# Altium schematic sheet C_M.SchDoc
size A4
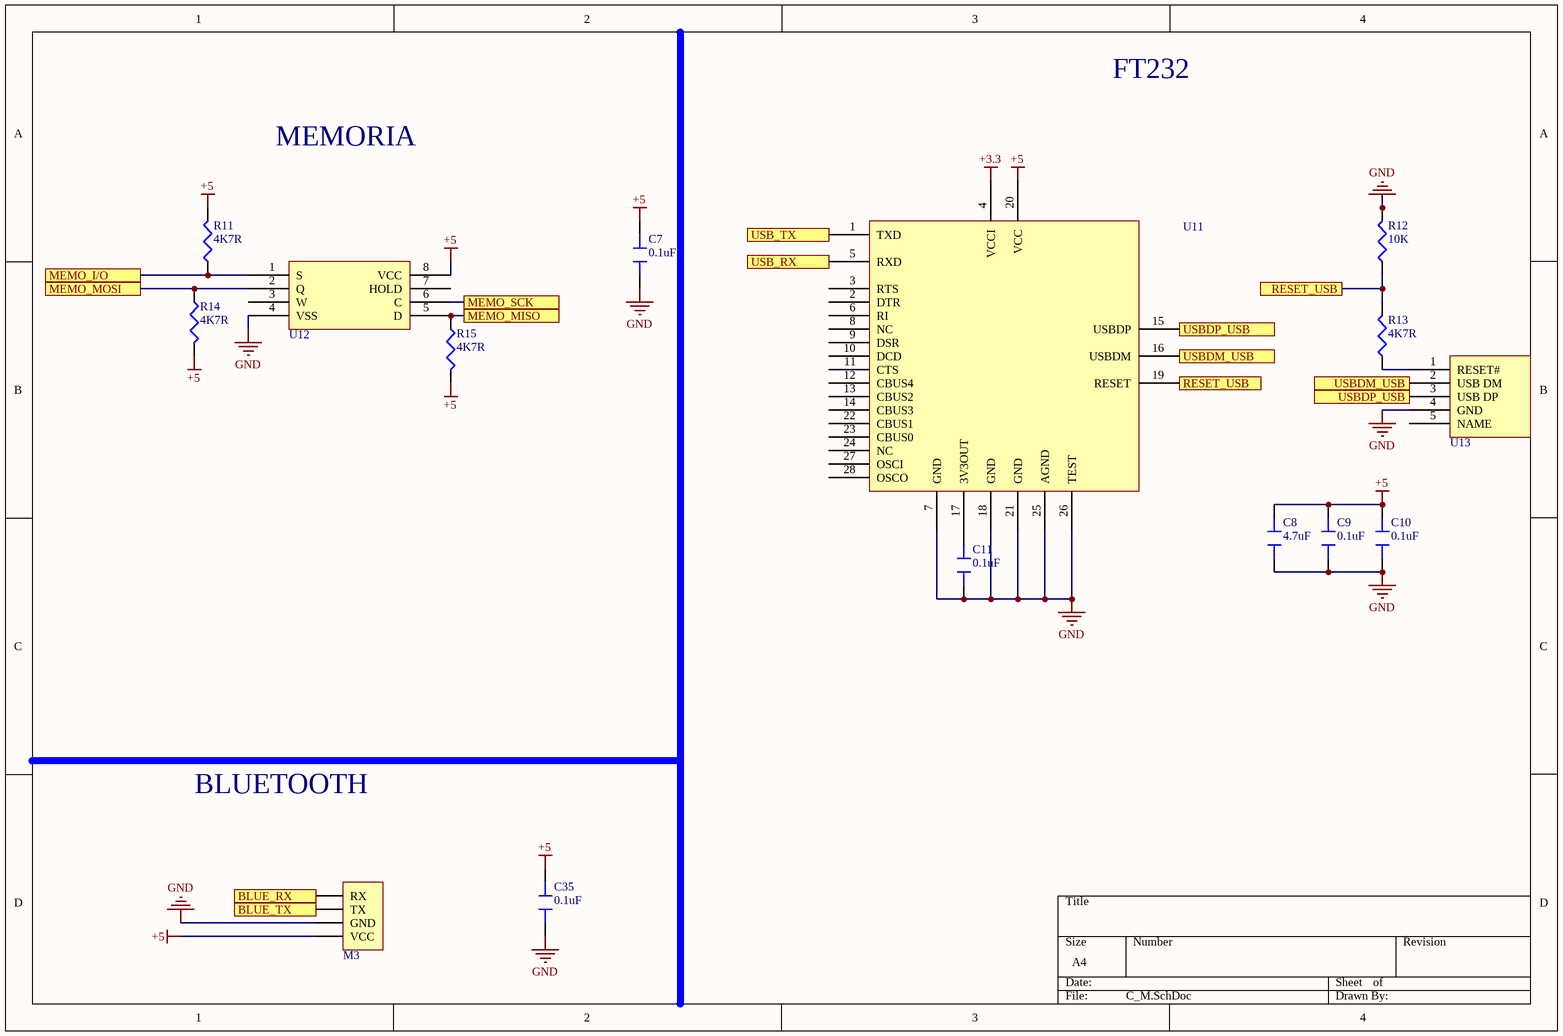
[diagram p0: C_M.SchDoc]

## Parts
C7  0.1uF  [CAPACITOR 0805]
C8  4.7uF  [CAPACITOR 0805]
C9  0.1uF  [CAPACITOR 0805]
C10  0.1uF  [CAPACITOR 0805]
C11  0.1uF  [CAPACITOR 0805]
C35  0.1uF  [CAPACITOR 0805]
M3  Headers (1x4)_BLUE  [HDR1X4]  (value not drawn)
R11  4K7R  [6-0805_M]
R12  10K  [6-0805_M]
R13  4K7R  [6-0805_M]
R14  4K7R  [6-0805_M]
R15  4K7R  [6-0805_M]
U11  USB Interface  [SOP65P780X200-28N]  (value not drawn)
U12  EEPROM 256Kbit  [M95256-DRMN8TP/K]  (value not drawn)
U13  USB Connectors  [USB Micro]  (value not drawn)

## Ports
BLUE_RX, BLUE_TX, MEMO_I/O, MEMO_MISO, MEMO_MOSI, MEMO_SCK, RESET_USB, USB_RX, USB_TX, USBDM_USB, USBDP_USB

## Nets
+3.3: U11.4(VCCI)
+5: C7.2 C8.2 C9.2 C10.2 C35.2 M3.4(VCC) R11.2 R14.2 R15.2 U11.20(VCC) U12.8(VCC)
GND: C7.1 C8.1 C9.1 C10.1 C11.1 C35.1 M3.3(GND) R12.2 U11.7(GND) U11.18(GND) U11.21(GND) U11.25(AGND) U11.26(TEST) U12.4(VSS) U13.4(GND)
BLUE_RX: M3.1(RX) ; port BLUE_RX
BLUE_TX: M3.2(TX) ; port BLUE_TX
MEMO_I/O: R11.1 U12.1(S) ; port MEMO_I/O
MEMO_MISO: R15.1 U12.5(D) ; port MEMO_MISO
MEMO_MOSI: R14.1 U12.2(Q) ; port MEMO_MOSI
MEMO_SCK: U12.6(C) ; port MEMO_SCK
RESET_USB: R12.1 R13.2 U11.19(RESET) ; port RESET_USB
USB_RX: U11.5(RXD) ; port USB_RX
USB_TX: U11.1(TXD) ; port USB_TX
USBDM_USB: U11.16(USBDM) U13.2(USB_DM) ; port USBDM_USB
USBDP_USB: U11.15(USBDP) U13.3(USB_DP) ; port USBDP_USB
NetC11_2: C11.2 U11.17(3V3OUT)
NetR13_1: R13.1 U13.1(RESET#)

Not connected (* = marked no-connect by the designer): U11 2(DTR) 3(RTS) 6(RI) 8(NC) 9(DSR) 10(DCD) 11(CTS) 12(CBUS4) 13(CBUS2) 14(CBUS3) 22(CBUS1) 23(CBUS0) 24(NC) 27(OSCI) 28(OSCO); U12 3(W) 7(HOLD); U13 5(NAME)

## Notes on the sheet
- FT232
- MEMORIA
- BLUETOOTH

## Library data of the parts
C7 C9-C11 C35 = Capacitor  0.1uF 0805: Multilayer Ceramic Capacitors MLCC - SMD/SMT .1uF 50volts 10%; Manufacturer: Vishay Vitramon; Manufacturer Part Number: VJ0805Y104KXAAT; Capacitance: 100nF; Voltage Rating: 50V; Dielectric: X7R; Supplier 1: Mouser; Stock 1: 207342; Pricing 1: 1=0.2, 10=0.2, 50=0.162, 100=0.108, 500=0.095, 1000=0.084, 3000=0.072, 6000=0.069, 9000=0.065, 10000=0.065 (USD); Mount: Surface Mount; Case/Package: 0805; Weight: 0.000194oz; Case Code (Metric): 2012; Case Code (Imperial): 0805; Min Operating Temperature: -55°C; Max Operating Temperature: 125°C; Tolerance: 10%; Package Quantity: 1; Packaging: Tape and Reel; Voltage Rating (DC): 50V; Termination: SMD/SMT; Voltage: 50V; Length: 2mm; Height: 1.45mm; Width: 0.049inch; Thickness: 0.057inch; Depth: 1.25mm; Radiation Hardening: No; REACH SVHC: Unknown; Lead Free: Lead Free; ComponentLink1URL: http://www.mouser.com/ds/2/427/vjcommercialseries-222796.pdf?src-supplier=Mouser; ComponentLink1Description: http://www.mouser.com/ds/2/427/vjcommercialseries-222796.pdf?src-supplier=Mouser; ComponentLink2URL: http://www.vishay.com/docs/45199/vjcommercialseries.pdf?src-supplier=Digi-Key; ComponentLink2Description: http://www.vishay.com/docs/45199/vjcommercialseries.pdf?src-supplier=Digi-Key; ComponentLink3URL: http://www.vishay.com/docs/45199/vjcommercialseries.pdf?src-supplier=Future+Electronics; ComponentLink3Description: http://www.vishay.com/docs/45199/vjcommercialseries.pdf?src-supplier=Future+Electronics; Supplier Part Number 1: 77-VJ0805Y104KXAAT; Category: Multilayer Ceramic Capacitors MLCC - SMD/SMT
C8 = Capacitor 4.7uF 0805: MURATA - GRM21BR61H475KE51L - CAP, 4.7µF, 50V, 10%, X5R, 0805; Material: Ceramic; Supplier 1: Mouser; Manufacturer: Murata; Manufacturer Part Number: GRM21BR61H475KE51L; Stock 1: 243744; Pricing 1: 1=0.37, 10=0.256, 50=0.256, 100=0.153, 500=0.115, 1000=0.097, 3000=0.08, 6000=0.075, 9000=0.071, 10000=0.071 (USD); Mount: Surface Mount; Case/Package: 0805; Case Code (Metric): 2012; Case Code (Imperial): 0805; Min Operating Temperature: -55°C; Max Operating Temperature: 85°C; Capacitance: 4.7uF; Tolerance: 10%; Packaging: Tape and Reel; Dielectric: X5R; Voltage Rating: 50V; Voltage Rating (DC): 50V; Length: 2mm; Height: 1.25mm; Width: 0.049inch; Thickness: 0.055inch; Depth: 1.25mm; REACH SVHC: No SVHC; Lead Free: Lead Free; ComponentLink1URL: http://components.arrow.com/part/dataview/61084395S454511N2606?src-supplier=Arrow; ComponentLink1Description: http://components.arrow.com/part/dataview/61084395S454511N2606?src-supplier=Arrow; ComponentLink2URL: http://components.arrow.com/part/dataview/0323_07281654?src-supplier=Arrow+Europe; ComponentLink2Description: http://components.arrow.com/part/dataview/0323_07281654?src-supplier=Arrow+Europe; ComponentLink3URL: https://search.murata.co.jp/Ceramy/image/img/A01X/G101/ENG/GRM21BR61H475KE51-01.pdf?src-supplier=Digi-Key; ComponentLink3Description: https://search.murata.co.jp/Ceramy/image/img/A01X/G101/ENG/GRM21BR61H475KE51-01.pdf?src-supplier=Digi-Key; ComponentLink4URL: http://search.murata.co.jp/Ceramy/image/img/A01X/G101/ENG/GRM21BR61H475KE51-01.pdf?src-supplier=Digi-Key; ComponentLink4Description: http://search.murata.co.jp/Ceramy/image/img/A01X/G101/ENG/GRM21BR61H475KE51-01.pdf?src-supplier=Digi-Key; ComponentLink5URL: http://www.farnell.com/datasheets/2079186.pdf?src-supplier=Farnell; ComponentLink5Description: http://www.farnell.com/datasheets/2079186.pdf?src-supplier=Farnell; ComponentLink6URL: http://www.farnell.com/datasheets/2079186.pdf?src-supplier=Element14; ComponentLink6Description: http://www.farnell.com/datasheets/2079186.pdf?src-supplier=Element14; ComponentLink7URL: http://www.farnell.com/datasheets/2079186.pdf?src-supplier=Newark; ComponentLink7Description: http://www.farnell.com/datasheets/2079186.pdf?src-supplier=Newark; Supplier Part Number 1: 81-GRM21BR61H475KE1L; Category: Multilayer Ceramic Capacitors MLCC - SMD/SMT
M3 = Headers (1x4)_BLUE: Header, 4-Pin; LatestRevisionDate: 17-Jul-2002; LatestRevisionNote: Re-released for DXP Platform.; Publisher: Altium Limited
R11 R13-R15 = Resistor 4.7K 0805: RES SMD 4.7K OHM 1% 1/8W 0805; Manufacturer: Vishay; Manufacturer Part Number: CRCW08054K70FKEA; Resistance: 4.7kR; Power Rating: 125mW; Voltage Rating: 150V; Temperature Coefficient: 100ppm/°C; Supplier 1: Mouser; Stock 1: 49115; Pricing 1: 1=0.1, 10=0.066, 50=0.066, 100=0.047, 1000=0.027, 10000=0.015 (USD); Case/Package: 0805; Weight: 0.000194oz; Case Code (Imperial): 0805; Case Code (Metric): 2012; Contact Plating: Tin; Min Operating Temperature: -55°C; Max Operating Temperature: 155°C; Tolerance: 1%; Packaging: Tape and Reel; Package Quantity: 10; Composition: Thick Film; Number of Terminations: 2; Termination: SMD/SMT; Military Standard: Not; Max Power Dissipation: 125mW; Voltage Rating (DC): 150V; Features: Automotive AEC-Q200; Length: 2mm; Height: 0.45mm; Width: 1.25mm; Depth: 1.25mm; Radiation Hardening: No; REACH SVHC: Unknown; Lead Free: Lead Free; ComponentLink1URL: http://uk.rs-online.com/webdocs/0d98/0900766b80d98b26.pdf?src-supplier=RSComponents; ComponentLink1Description: http://uk.rs-online.com/webdocs/0d98/0900766b80d98b26.pdf?src-supplier=RSComponents; ComponentLink2URL: http://www.vishay.com/docs/20035/dcrcwe3.pdf?src-supplier=Future+Electronics; ComponentLink2Description: http://www.vishay.com/docs/20035/dcrcwe3.pdf?src-supplier=Future+Electronics; ComponentLink3URL: http://www.alliedelec.com/m/d/0c934d6939ccefa68dbe0b96d821c8cf.pdf?src-supplier=Allied+Electronics; ComponentLink3Description: http://www.alliedelec.com/m/d/0c934d6939ccefa68dbe0b96d821c8cf.pdf?src-supplier=Allied+Electronics; ComponentLink4URL: http://www.mouser.com/ds/2/427/dcrcwe3-109170.pdf?src-supplier=Mouser; ComponentLink4Description: http://www.mouser.com/ds/2/427/dcrcwe3-109170.pdf?src-supplier=Mouser; ComponentLink5URL: https://www.distrelec.biz/Web/Downloads/a_/en/flD-CRCW-e3_data_en.pdf?mime=application%2Fpdf&src-supplier=Distrelec; ComponentLink5Description: https://www.distrelec.biz/Web/Downloads/a_/en/flD-CRCW-e3_data_en.pdf?mime=application%2Fpdf&src-supplier=Distrelec; ComponentLink6URL: http://www.vishay.com/docs/20035/dcrcwe3.pdf?src-supplier=Avnet; ComponentLink6Description: http://www.vishay.com/docs/20035/dcrcwe3.pdf?src-supplier=Avnet; ComponentLink7URL: http://www.vishay.com/docs/20035/dcrcwe3.pdf?src-supplier=Digi-Key; ComponentLink7Description: http://www.vishay.com/docs/20035/dcrcwe3.pdf?src-supplier=Digi-Key; Supplier Part Number 1: 71-CRCW0805-4.7K-E3; Category: Thick Film Resistors - SMD
R12 = Resistor 10k 0805: RES SMD 10K OHM 1% 1/8W 0805; Manufacturer: Vishay; Manufacturer Part Number: CRCW080510K0FKEA; Resistance: 10kR; Power Rating: 125mW; Voltage Rating: 150V; Temperature Coefficient: 100ppm/°C; Supplier 1: Mouser; Stock 1: 474662; Pricing 1: 1=0.1, 10=0.066, 50=0.066, 100=0.06, 1000=0.043, 10000=0.019 (USD); Case/Package: 0805; Weight: 0.000194oz; Case Code (Imperial): 0805; Case Code (Metric): 2012; Contact Plating: Tin; Min Operating Temperature: -55°C; Max Operating Temperature: 155°C; Tolerance: 1%; Packaging: Tape and Reel; Package Quantity: 5000; Composition: Thick Film; Military Standard: Not; Termination: SMD/SMT; Voltage Rating (DC): 150V; Length: 2mm; Height: 0.45mm; Width: 1.25mm; Depth: 1.25mm; Radiation Hardening: No; REACH SVHC: Unknown; Lead Free: Lead Free; ComponentLink1URL: http://www.mouser.com/ds/2/427/dcrcwe3-109170.pdf?src-supplier=Mouser; ComponentLink1Description: http://www.mouser.com/ds/2/427/dcrcwe3-109170.pdf?src-supplier=Mouser; ComponentLink2URL: http://uk.rs-online.com/webdocs/0d98/0900766b80d98b26.pdf?src-supplier=RSComponents; ComponentLink2Description: http://uk.rs-online.com/webdocs/0d98/0900766b80d98b26.pdf?src-supplier=RSComponents; ComponentLink3URL: http://www.alliedelec.com/m/d/0c934d6939ccefa68dbe0b96d821c8cf.pdf?src-supplier=Allied+Electronics; ComponentLink3Description: http://www.alliedelec.com/m/d/0c934d6939ccefa68dbe0b96d821c8cf.pdf?src-supplier=Allied+Electronics; ComponentLink4URL: http://www.vishay.com/docs/20035/dcrcwe3.pdf?src-supplier=Avnet+Asia; ComponentLink4Description: http://www.vishay.com/docs/20035/dcrcwe3.pdf?src-supplier=Avnet+Asia; ComponentLink5URL: http://www.vishay.com/docs/20035/dcrcwe3.pdf?src-supplier=Avnet+Europe; ComponentLink5Description: http://www.vishay.com/docs/20035/dcrcwe3.pdf?src-supplier=Avnet+Europe; ComponentLink6URL: http://www.vishay.com/docs/20035/dcrcwe3.pdf?src-supplier=Avnet; ComponentLink6Description: http://www.vishay.com/docs/20035/dcrcwe3.pdf?src-supplier=Avnet; ComponentLink7URL: http://www.farnell.com/datasheets/2310790.pdf?src-supplier=Element14; ComponentLink7Description: http://www.farnell.com/datasheets/2310790.pdf?src-supplier=Element14; ComponentLink8URL: http://www.vishay.com/docs/20035/dcrcwe3.pdf?src-supplier=Future+Electronics; ComponentLink8Description: http://www.vishay.com/docs/20035/dcrcwe3.pdf?src-supplier=Future+Electronics; Supplier Part Number 1: 71-CRCW0805-10K-E3; Category: Thick Film Resistors - SMD
U11 = USB Interface: IC USB FS SERIAL UART 28-SSOP; Manufacturer: FTDI; Manufacturer Part Number: FT232RL-REEL; Number of Channels: 1; Max Supply Voltage: 5.25V; Min Supply Voltage: 3.3V; Data Rate: 12Mbps; Interface: UART,RS-232,RS-422,RS-485; Operating Supply Current: 15mA; Voltage: 5V; Supplier 1: Mouser; Stock 1: 115709; Pricing 1: 1=4.5, 10=4.05, 50=3.85, 100=3.65, 250=3.25, 500=2.85, 1000=2.65, 6000=2.35, 10000=2.65 (USD); Mount: Surface Mount; Case/Package: SSOP; Number of Pins: 28; Weight: 0.080001oz; Min Operating Temperature: -40°C; Max Operating Temperature: 85°C; Packaging: Tape and Reel; Package Quantity: 2000; Number of Transceivers: 1; Length: 10.2mm; Height: 1.75mm; Width: 5.3mm; Radiation Hardening: No; REACH SVHC: No SVHC; Lead Free: Lead Free; ComponentLink1URL: http://www.jameco.com/Jameco/Products/ProdDS/2161019.pdf?src-supplier=Jameco; ComponentLink1Description: http://www.jameco.com/Jameco/Products/ProdDS/2161019.pdf?src-supplier=Jameco; ComponentLink2URL: http://www.ftdichip.com/Support/Documents/AppNotes/AN_126_User_Guide_For_FT232_Factory%20test%20utility.pdf?src-supplier=Digi-Key; ComponentLink2Description: http://www.ftdichip.com/Support/Documents/AppNotes/AN_126_User_Guide_For_FT232_Factory%20test%20utility.pdf?src-supplier=Digi-Key; ComponentLink3URL: http://www.mouser.com/ds/2/163/DS_FT232R-11534.pdf?src-supplier=Mouser; ComponentLink3Description: http://www.mouser.com/ds/2/163/DS_FT232R-11534.pdf?src-supplier=Mouser; ComponentLink4URL: https://www.verical.com/server-webapp/html/getDatasheet?partID=643207&src-supplier=Verical; ComponentLink4Description: https://www.verical.com/server-webapp/html/getDatasheet?partID=643207&src-supplier=Verical; ComponentLink5URL: http://www.ftdichip.com/Support/Documents/DataSheets/ICs/DS_FT232R.pdf?src-supplier=Future+Electronics; ComponentLink5Description: http://www.ftdichip.com/Support/Documents/DataSheets/ICs/DS_FT232R.pdf?src-supplier=Future+Electronics; ComponentLink6URL: http://datasheet.iiic.cc/ftdi/FT232RL-REEL.pdf?src-supplier=IIIC; ComponentLink6Description: http://datasheet.iiic.cc/ftdi/FT232RL-REEL.pdf?src-supplier=IIIC; Supplier Part Number 1: 895-FT232RL; Category: USB Interface IC
U12 = EEPROM 256Kbit: IC EEPROM 256KBIT 2MHZ 8SOIC; Manufacturer: STMicroelectronics; Interface: SPI,Serial; Supplier 1: Mouser; Manufacturer Part Number: M95256-DRMN8TP/K; Stock 1: 2067; Pricing 1: 1=0.74, 10=0.657, 50=0.657, 100=0.582, 500=0.573, 1000=0.553, 2500=0.461, 5000=0.456, 10000=0.441, 25000=0.395 (USD); Case/Package: SOIC; Number of Pins: 8; Min Operating Temperature: -40°C; Max Operating Temperature: 105°C; Packaging: Tape and Reel; Memory Type: EEPROM; Frequency: 2MHz; ComponentLink1URL: http://www.mouser.com/ds/2/389/DM00159861-542294.pdf?src-supplier=Mouser; ComponentLink1Description: http://www.mouser.com/ds/2/389/DM00159861-542294.pdf?src-supplier=Mouser; ComponentLink2URL: http://www.st.com/st-web-ui/static/active/en/resource/technical/document/datasheet/DM00159861.pdf?src-supplier=Avnet; ComponentLink2Description: http://www.st.com/st-web-ui/static/active/en/resource/technical/document/datasheet/DM00159861.pdf?src-supplier=Avnet; ComponentLink3URL: http://www.st.com/content/ccc/resource/technical/document/datasheet/group3/c8/e0/71/cd/07/cf/48/38/DM00159861/files/DM00159861.pdf/jcr:content/translations/en.DM00159861.pdf?src-supplier=Digi-Key; ComponentLink3Description: http://www.st.com/content/ccc/resource/technical/document/datasheet/group3/c8/e0/71/cd/07/cf/48/38/DM00159861/files/DM00159861.pdf/jcr:content/translations/en.DM00159861.pdf?src-supplier=Digi-Key; Supplier Part Number 1: 511-M95256-DRMN8TP/K; Category: EEPROM
U13 = USB Connectors: MOLEX         67643-0910            USB, 2.0 TYPE A, RECEPTACLE, SMT; Max Voltage Rating (DC): 30V; Gender: Female; Current Rating: 1.5A; Connector Type: USB,Receptacle; Number of Ports: 1; Number of Contacts: 4; USB Standard: USB 2.0; Manufacturer: Molex; Manufacturer Part Number: 67643-0910; Mount: Through Hole; Contact Plating: Gold; Contact Material: Bronze; Number of Terminals: 4; Housing Color: Black; Housing Material: Polyester; Min Operating Temperature: 0°C; Max Operating Temperature: 50°C; Packaging: Tray; Voltage Rating (DC): 30V; Termination: Solder; Voltage Rating: 30V; Orientation: Right Angle; Number of Positions: 4; Number of Circuits: 4; Length: 14.4mm; Depth: 15.26mm; Radiation Hardening: No; REACH SVHC: Unknown; Lead Free: Lead Free; Flammability Rating: UL94 V-0; ComponentLink1URL: http://www.molex.com/webdocs/datasheets/pdf/en-us/0676430910_IO_CONNECTORS.pdf?src-supplier=Avnet+Europe; ComponentLink1Description: http://www.molex.com/webdocs/datasheets/pdf/en-us/0676430910_IO_CONNECTORS.pdf?src-supplier=Avnet+Europe; ComponentLink2URL: http://www.mouser.com/ds/2/276/0676430910_IO_CONNECTORS-172292.pdf?src-supplier=Mouser; ComponentLink2Description: http://www.mouser.com/ds/2/276/0676430910_IO_CONNECTORS-172292.pdf?src-supplier=Mouser; ComponentLink3URL: https://www.verical.com/server-webapp/html/getDatasheet?partID=758674&src-supplier=Verical; ComponentLink3Description: https://www.verical.com/server-webapp/html/getDatasheet?partID=758674&src-supplier=Verical; ComponentLink4URL: http://www.farnell.com/datasheets/1865732.pdf?src-supplier=Element14; ComponentLink4Description: http://www.farnell.com/datasheets/1865732.pdf?src-supplier=Element14; Category: USB Connectors